# Altium schematic sheet 16-DDR4 ECC AND TERMINATIONS.SchDoc
size 513 x 386 mm
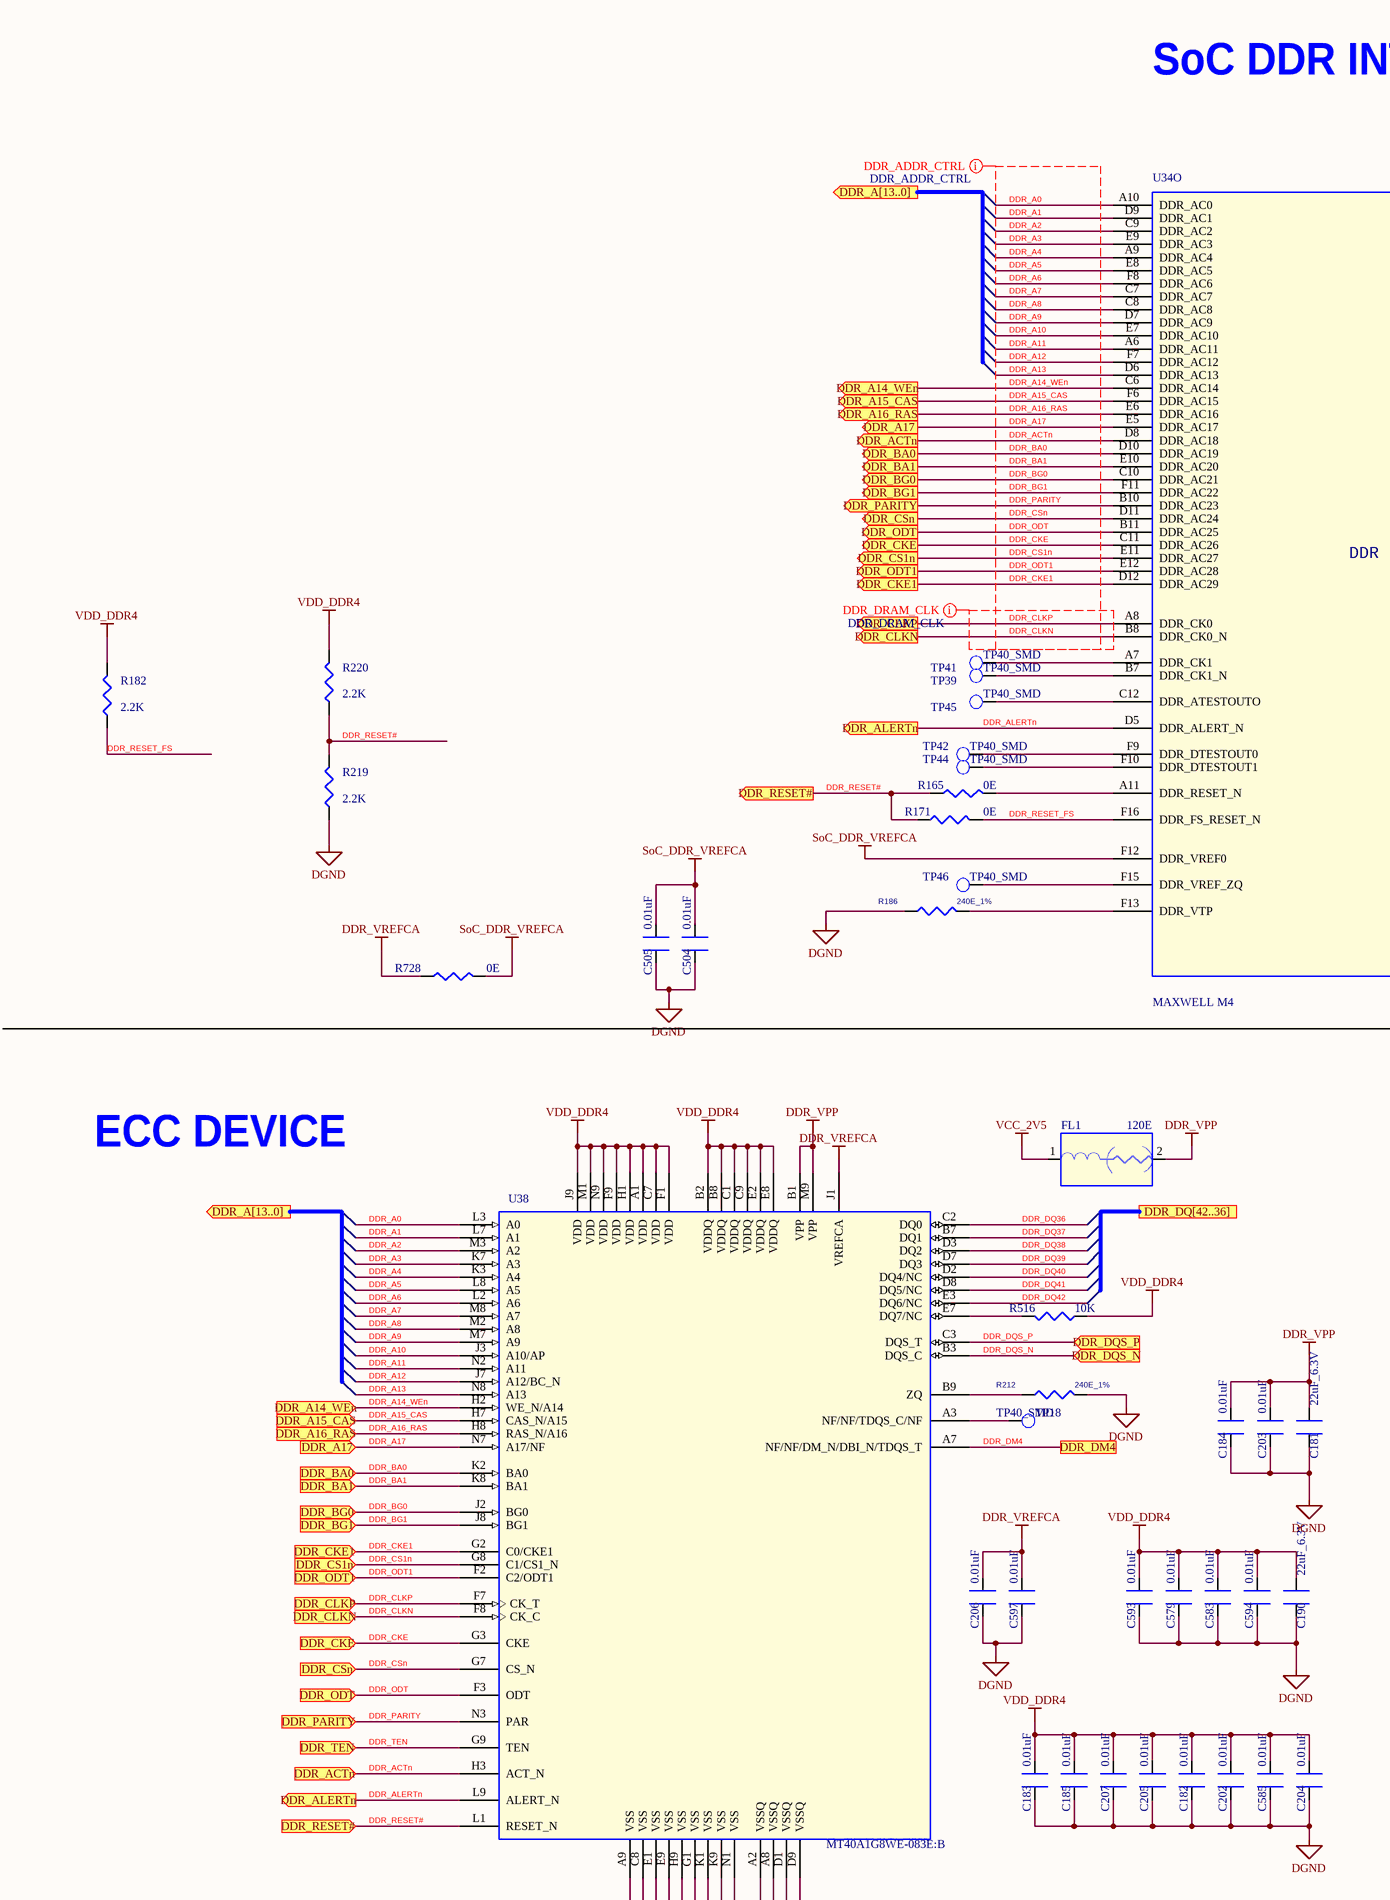
[diagram p0: 16-DDR4 ECC AND TERMINATIONS.SchDoc, top left]
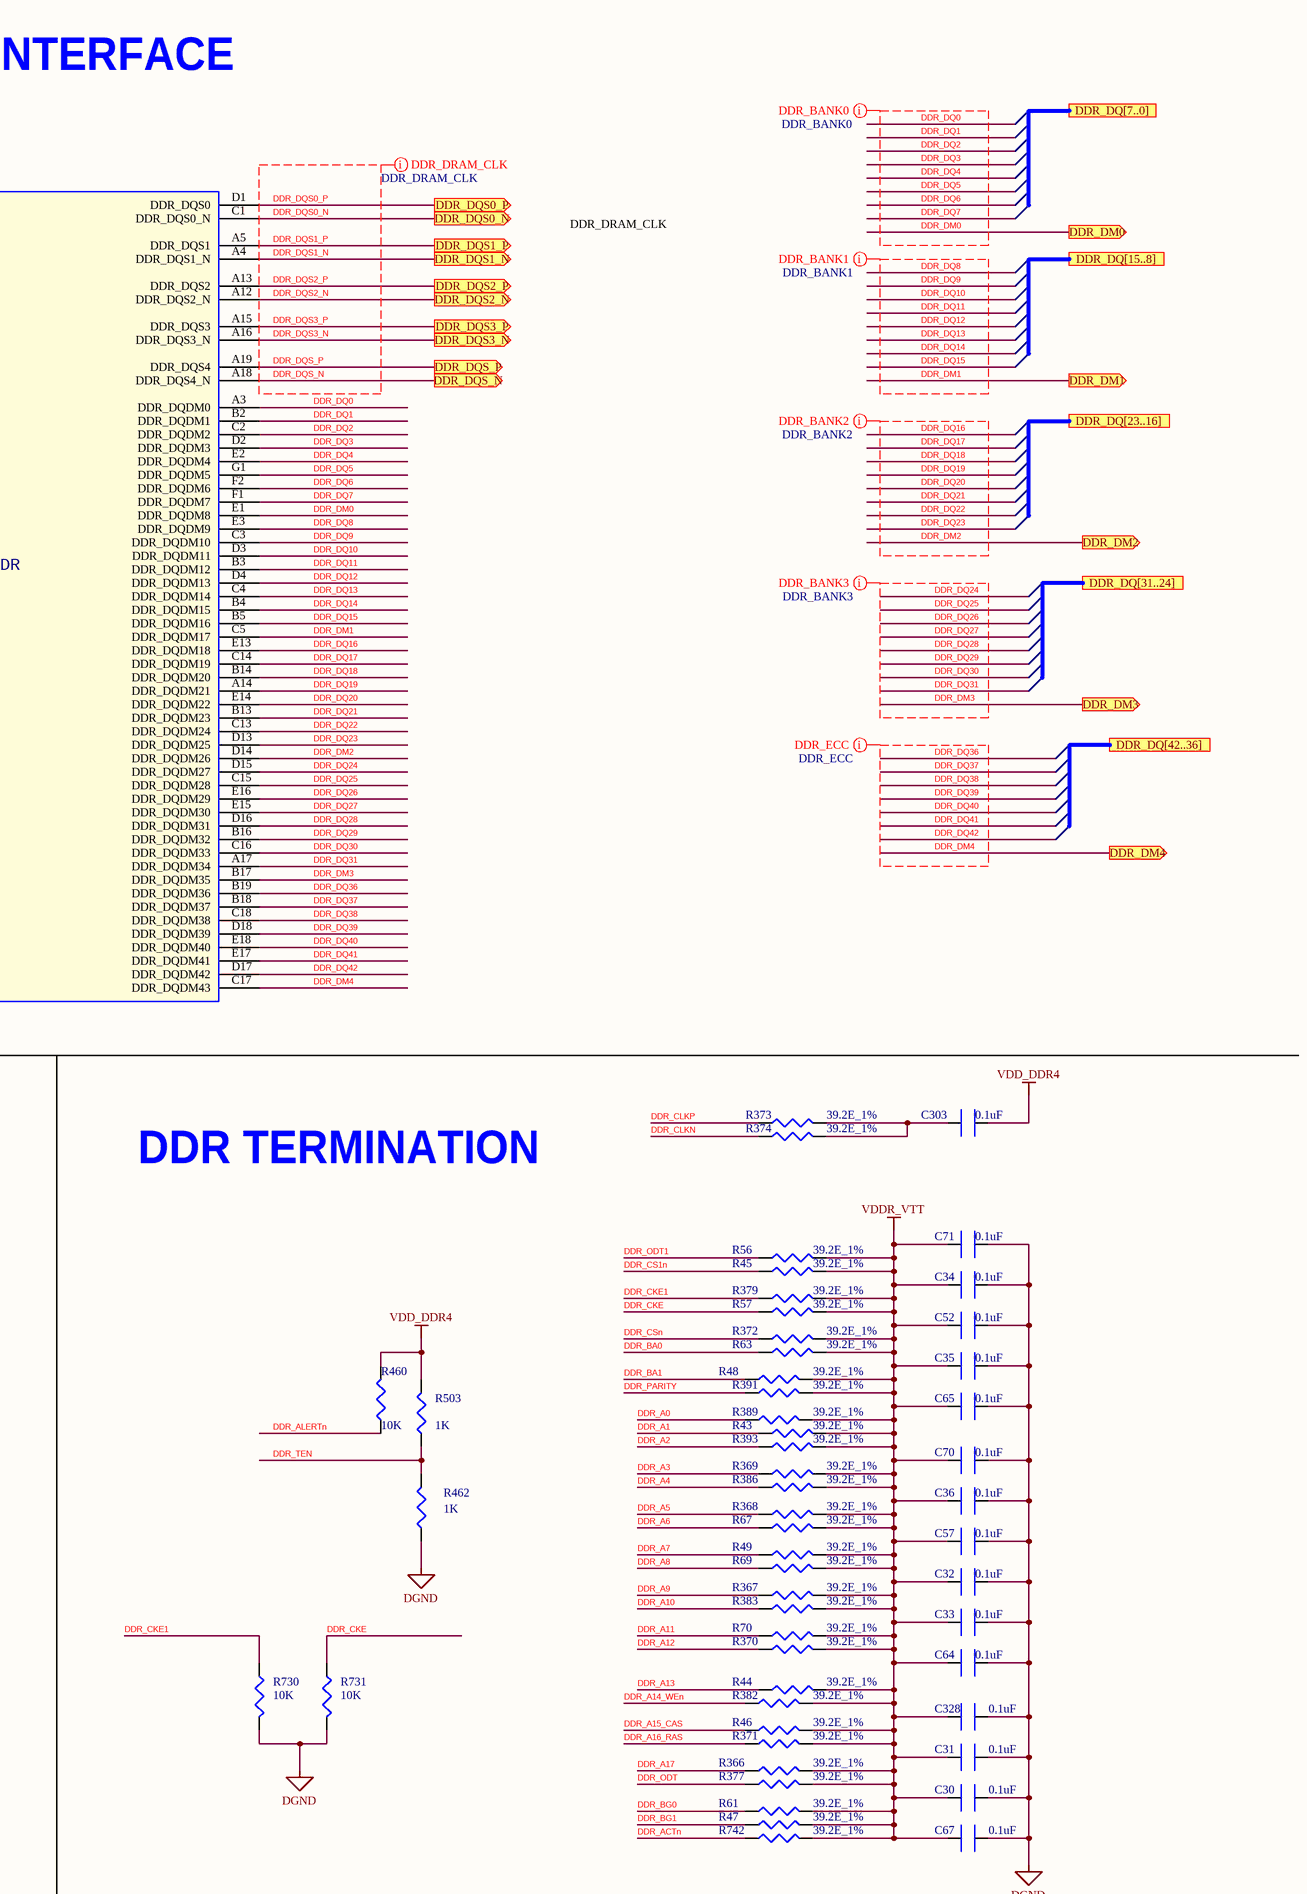
[diagram p1: 16-DDR4 ECC AND TERMINATIONS.SchDoc, top right]
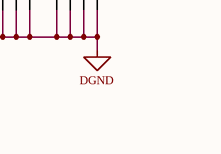
[diagram p2: 16-DDR4 ECC AND TERMINATIONS.SchDoc, bottom left]
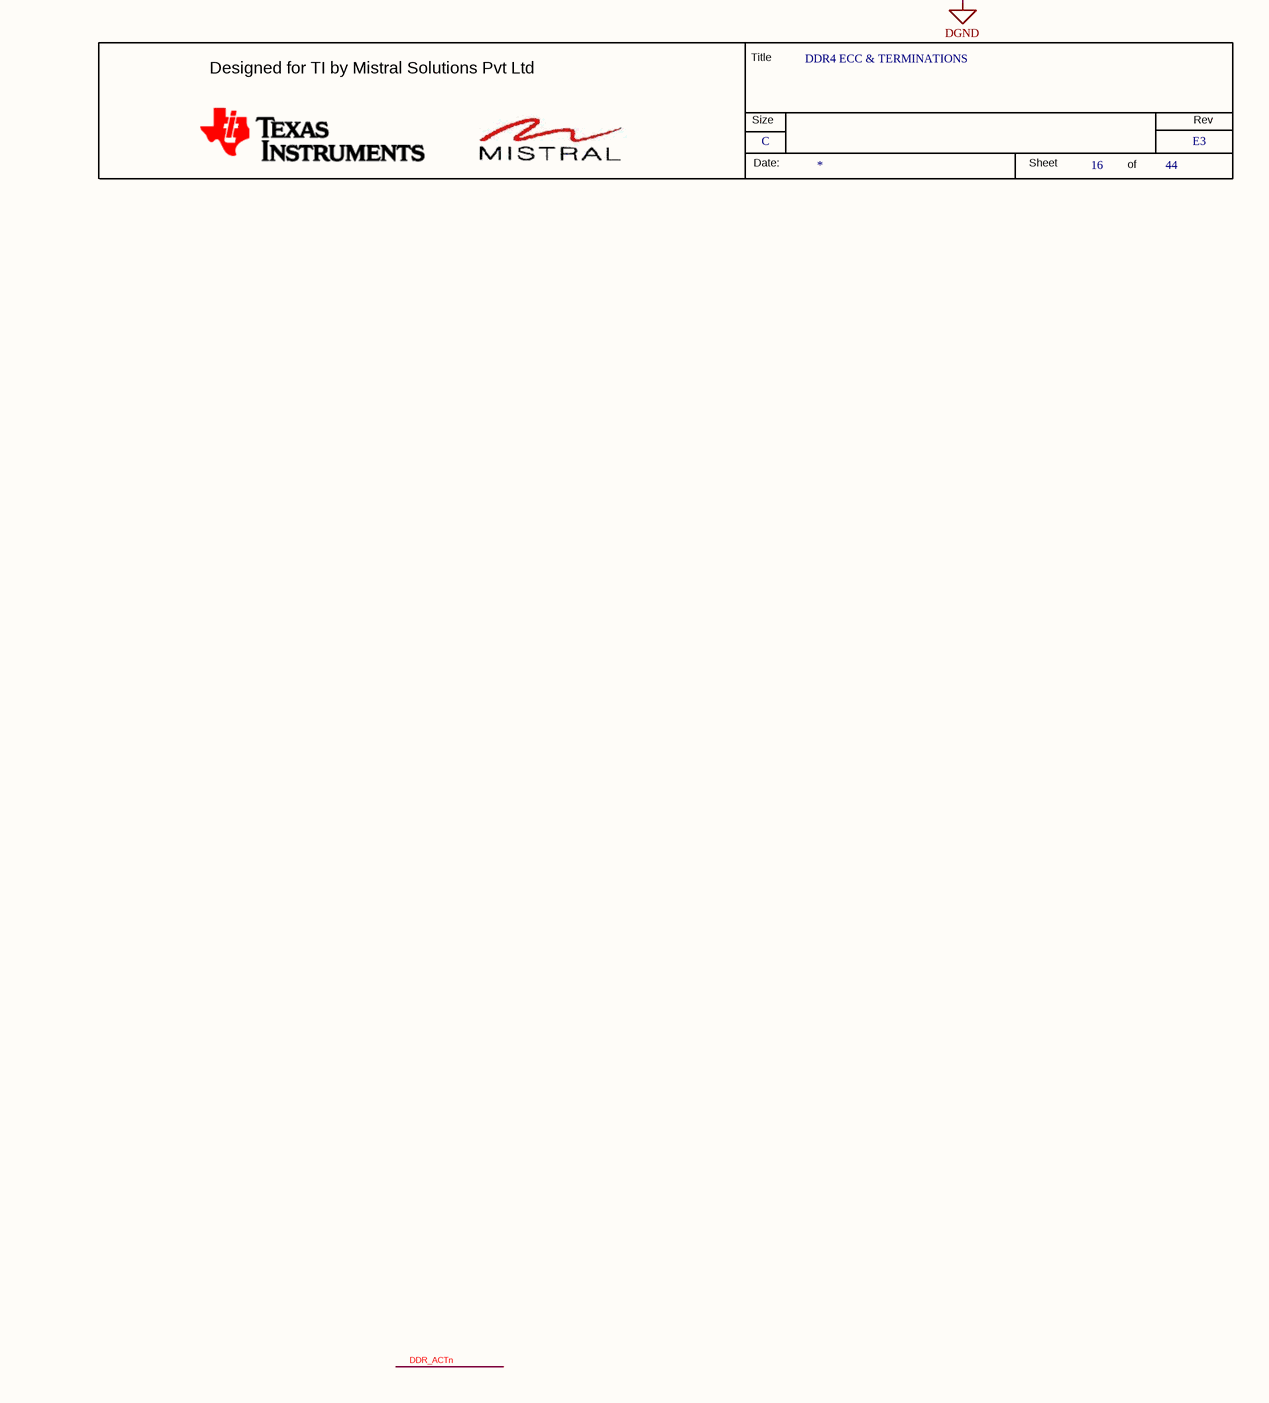
[diagram p3: 16-DDR4 ECC AND TERMINATIONS.SchDoc, bottom right]

## Parts
*  RevCode: E3  Title: DDR4 ECC & TERMINATIONS  Page Size: C  Page Number: 16  Page Count: 44  (hidden comment: MISTRAL_TITLEBLK_CSIZE)  (graphical)
C30  0.1uF  [CAP0201_0-5]
C31  0.1uF  [CAP0201_0-5]
C32  0.1uF  [CAP0201_0-5]
C33  0.1uF  [CAP0201_0-5]
C34  0.1uF  [CAP0201_0-5]
C35  0.1uF  [CAP0201_0-5]
C36  0.1uF  [CAP0201_0-5]
C52  0.1uF  [CAP0201_0-5]
C57  0.1uF  [CAP0201_0-5]
C64  0.1uF  [CAP0201_0-5]
C65  0.1uF  [CAP0201_0-5]
C67  0.1uF  [CAP0201_0-5]
C70  0.1uF  [CAP0201_0-5]
C71  0.1uF  [CAP0201_0-5]
C181  22uF_6.3V  [CAP0603]
C182  0.01uF  [CAP0201_0-5]
C183  0.01uF  [CAP0201_0-5]
C184  0.01uF  [CAP0201_0-5]
C185  0.01uF  [CAP0201_0-5]
C190  22uF_6.3V  [CAP0603]
C202  0.01uF  [CAP0201_0-5]
C203  0.01uF  [CAP0201_0-5]
C204  0.01uF  [CAP0201_0-5]
C205  0.01uF  [CAP0201_0-5]
C206  0.01uF  [CAP0201_0-5]
C207  0.01uF  [CAP0201_0-5]
C303  0.1uF  [CAP0201_0-5]
C328  0.1uF  [CAP0201_0-5]
C504  0.01uF  [CAP0201_0-5]
C505  0.01uF  [CAP0201_0-5]
C579  0.01uF  [CAP0201_0-5]
C583  0.01uF  [CAP0201_0-5]
C585  0.01uF  [CAP0201_0-5]
C593  0.01uF  [CAP0201_0-5]
C594  0.01uF  [CAP0201_0-5]
C597  0.01uF  [CAP0201_0-5]
FL1  120E  [EMIFIL_BLM15A_0402_0-6]
R43  39.2E_1%  [RES0402]
R44  39.2E_1%  [RES0402]
R45  39.2E_1%  [RES0402]
R46  39.2E_1%  [RES0402]
R47  39.2E_1%  [RES0402]
R48  39.2E_1%  [RES0402]
R49  39.2E_1%  [RES0402]
R56  39.2E_1%  [RES0402]
R57  39.2E_1%  [RES0402]
R61  39.2E_1%  [RES0402]
R63  39.2E_1%  [RES0402]
R67  39.2E_1%  [RES0402]
R69  39.2E_1%  [RES0402]
R70  39.2E_1%  [RES0402]
R165  0E  [RES0402_0-5]
R171  0E  [RES0402_0-5]
R182  2.2K  [RES0402_0-5]
R186  240E_1%  [RES0402]
R212  240E_1%  [RES0402]
R219  2.2K  [RES0402_0-5]
R220  2.2K  [RES0402_0-5]
R366  39.2E_1%  [RES0402]
R367  39.2E_1%  [RES0402]
R368  39.2E_1%  [RES0402]
R369  39.2E_1%  [RES0402]
R370  39.2E_1%  [RES0402]
R371  39.2E_1%  [RES0402]
R372  39.2E_1%  [RES0402]
R373  39.2E_1%  [RES0402]
R374  39.2E_1%  [RES0402]
R377  39.2E_1%  [RES0402]
R379  39.2E_1%  [RES0402]
R382  39.2E_1%  [RES0402]
R383  39.2E_1%  [RES0402]
R386  39.2E_1%  [RES0402]
R389  39.2E_1%  [RES0402]
R391  39.2E_1%  [RES0402]
R393  39.2E_1%  [RES0402]
R460  10K  [RES0402_0-5]
R462  1K  [RES0201]
R503  1K  [RES0201]
R516  10K  [RES0402_0-5]
R728  0E  [RES0402_0-5]
R730  10K  [RES0402_0-5]
R731  10K  [RES0402_0-5]
R742  39.2E_1%  [RES0402]
TP18  TP40_SMD  [TP40_SMD]
TP39  TP40_SMD  [TP40_SMD]
TP41  TP40_SMD  [TP40_SMD]
TP42  TP40_SMD  [TP40_SMD]
TP44  TP40_SMD  [TP40_SMD]
TP45  TP40_SMD  [TP40_SMD]
TP46  TP40_SMD  [TP40_SMD]
U34  MAXWELL M4  [BGA784_31-49_910X910_1-7]  (part O of 19)
U38  MT40A1G8WE-083E:B  [FBGA78_31-49_320X480_1-2]

## Ports
DDR_A14_WEn (in), DDR_A14_WEn (out), DDR_A15_CAS (in), DDR_A15_CAS (out), DDR_A16_RAS (in), DDR_A16_RAS (out), DDR_A17 (in), DDR_A17 (out), DDR_A[13..0] (out), DDR_ACTn (in), DDR_ACTn (out), DDR_ALERTn (out), DDR_BA0 (in), DDR_BA0 (out), DDR_BA1 (in), DDR_BA1 (out), DDR_BG0 (in), DDR_BG0 (out), DDR_BG1 (in), DDR_BG1 (out), DDR_CKE1 (in), DDR_CKE1 (out), DDR_CKE (in), DDR_CKE (out), DDR_CLKN (in), DDR_CLKN (out), DDR_CLKP (in), DDR_CLKP (out), DDR_CS1n (in), DDR_CS1n (out), DDR_CSn (in), DDR_CSn (out), DDR_DM0 (out), DDR_DM1 (out), DDR_DM2 (out), DDR_DM3 (out), DDR_DM4, DDR_DM4 (out), DDR_DQ[7..0], DDR_DQ[15..8], DDR_DQ[23..16], DDR_DQ[31..24], DDR_DQ[42..36], DDR_DQS0_N (out), DDR_DQS0_P (out), DDR_DQS1_N (out), DDR_DQS1_P (out), DDR_DQS2_N (out), DDR_DQS2_P (out), DDR_DQS3_N (out), DDR_DQS3_P (out), DDR_DQS_N (in), DDR_DQS_N (out), DDR_DQS_P (in), DDR_DQS_P (out), DDR_ODT1 (in), DDR_ODT1 (out), DDR_ODT (in), DDR_ODT (out), DDR_PARITY (in), DDR_PARITY (out), DDR_RESET# (in), DDR_RESET# (out), DDR_TEN (in)

## Nets
DDR_VPP: C181.1 C184.1 C203.1 FL1.2 U38.B1(VPP) U38.M9(VPP)
DDR_VREFCA: C206.1 C597.1 R728.1 U38.J1(VREFCA)
DGND: C30.2 C31.2 C32.2 C33.2 C34.2 C35.2 C36.2 C52.2 C57.2 C64.2 C65.2 C67.2 C70.2 C71.2 C181.2 C182.2 C183.2 C184.2 C185.2 C190.2 C202.2 C203.2 C204.2 C205.2 C206.2 C207.2 C328.2 C504.2 C505.2 C579.2 C583.2 C585.2 C593.2 C594.2 C597.2 R186.2 R212.2 R219.1 R462.1 R730.2 R731.2 U38.A2(VSSQ) U38.A8(VSSQ) U38.A9(VSS) U38.C8(VSS) U38.D1(VSSQ) U38.D9(VSSQ) U38.E1(VSS) U38.E9(VSS) U38.G1(VSS) U38.H9(VSS) U38.K1(VSS) U38.K9(VSS) U38.N1(VSS)
SoC_DDR_VREFCA: C504.1 C505.1 R728.2 U34.F12(DDR_VREF0)
VCC_2V5: FL1.1
VDD_DDR4: C182.1 C183.1 C185.1 C190.1 C202.1 C204.1 C205.1 C207.1 C303.1 C579.1 C583.1 C585.1 C593.1 C594.1 R182.2 R220.2 R460.2 R503.2 R516.1 U38.A1(VDD) U38.B2(VDDQ) U38.B8(VDDQ) U38.C1(VDDQ) U38.C7(VDD) U38.C9(VDDQ) U38.E2(VDDQ) U38.E8(VDDQ) U38.F1(VDD) U38.F9(VDD) U38.H1(VDD) U38.J9(VDD) U38.M1(VDD) U38.N9(VDD)
VDDR_VTT: C30.1 C31.1 C32.1 C33.1 C34.1 C35.1 C36.1 C52.1 C57.1 C64.1 C65.1 C67.1 C70.1 C71.1 C328.1 R43.2 R44.2 R45.2 R46.2 R47.2 R48.2 R49.2 R56.2 R57.2 R61.2 R63.2 R67.2 R69.2 R70.2 R366.2 R367.2 R368.2 R369.2 R370.2 R371.2 R372.2 R377.2 R379.2 R382.2 R383.2 R386.2 R389.2 R391.2 R393.2 R742.2
DDR_A0: R389.1 U34.A10(DDR_AC0) U38.L3(A0)
DDR_A1: R43.1 U34.D9(DDR_AC1) U38.L7(A1)
DDR_A2: R393.1 U34.C9(DDR_AC2) U38.M3(A2)
DDR_A3: R369.1 U34.E9(DDR_AC3) U38.K7(A3)
DDR_A4: R386.1 U34.A9(DDR_AC4) U38.K3(A4)
DDR_A5: R368.1 U34.E8(DDR_AC5) U38.L8(A5)
DDR_A6: R67.1 U34.F8(DDR_AC6) U38.L2(A6)
DDR_A7: R49.1 U34.C7(DDR_AC7) U38.M8(A7)
DDR_A8: R69.1 U34.C8(DDR_AC8) U38.M2(A8)
DDR_A9: R367.1 U34.D7(DDR_AC9) U38.M7(A9)
DDR_A10: R383.1 U34.E7(DDR_AC10) U38.J3(A10/AP)
DDR_A11: R70.1 U34.A6(DDR_AC11) U38.N2(A11)
DDR_A12: R370.1 U34.F7(DDR_AC12) U38.J7(A12/BC_N)
DDR_A13: R44.1 U34.D6(DDR_AC13) U38.N8(A13)
DDR_A14_WEn: R382.1 U34.C6(DDR_AC14) U38.H2(WE_N/A14) ; port DDR_A14_WEn
DDR_A15_CAS: R46.1 U34.F6(DDR_AC15) U38.H7(CAS_N/A15) ; port DDR_A15_CAS
DDR_A16_RAS: R371.1 U34.E6(DDR_AC16) U38.H8(RAS_N/A16) ; port DDR_A16_RAS
DDR_A17: R366.1 U34.E5(DDR_AC17) U38.N7(A17/NF) ; port DDR_A17
DDR_ACTn: R742.1 U34.D8(DDR_AC18) U38.H3(ACT_N) ; port DDR_ACTn
DDR_ALERTn: R460.1 U34.D5(DDR_ALERT_N) U38.L9(ALERT_N) ; port DDR_ALERTn
DDR_BA0: R63.1 U34.D10(DDR_AC19) U38.K2(BA0) ; port DDR_BA0
DDR_BA1: R48.1 U34.E10(DDR_AC20) U38.K8(BA1) ; port DDR_BA1
DDR_BG0: R61.1 U34.C10(DDR_AC21) U38.J2(BG0) ; port DDR_BG0
DDR_BG1: R47.1 U34.F11(DDR_AC22) U38.J8(BG1) ; port DDR_BG1
DDR_CKE: R57.1 R731.1 U34.C11(DDR_AC26) U38.G3(CKE) ; port DDR_CKE
DDR_CKE1: R379.1 R730.1 U34.D12(DDR_AC29) U38.G2(C0/CKE1) ; port DDR_CKE1
DDR_CLKN: R374.1 U34.B8(DDR_CK0_N) U38.F8(CK_C) ; port DDR_CLKN
DDR_CLKP: R373.1 U34.A8(DDR_CK0) U38.F7(CK_T) ; port DDR_CLKP
DDR_CS1n: R45.1 U34.E11(DDR_AC27) U38.G8(C1/CS1_N) ; port DDR_CS1n
DDR_CSn: R372.1 U34.D11(DDR_AC24) U38.G7(CS_N) ; port DDR_CSn
DDR_DM0: U34.E1(DDR_DQDM8) ; port DDR_DM0
DDR_DM1: U34.C5(DDR_DQDM17) ; port DDR_DM1
DDR_DM2: U34.D14(DDR_DQDM26) ; port DDR_DM2
DDR_DM3: U34.B17(DDR_DQDM35) ; port DDR_DM3
DDR_DM4: U34.C17(DDR_DQDM43) U38.A7(NF/NF/DM_N/DBI_N/TDQS_T) ; port DDR_DM4
DDR_DQ0: U34.A3(DDR_DQDM0)
DDR_DQ1: U34.B2(DDR_DQDM1)
DDR_DQ2: U34.C2(DDR_DQDM2)
DDR_DQ3: U34.D2(DDR_DQDM3)
DDR_DQ4: U34.E2(DDR_DQDM4)
DDR_DQ5: U34.G1(DDR_DQDM5)
DDR_DQ6: U34.F2(DDR_DQDM6)
DDR_DQ7: U34.F1(DDR_DQDM7)
DDR_DQ8: U34.E3(DDR_DQDM9)
DDR_DQ9: U34.C3(DDR_DQDM10)
DDR_DQ10: U34.D3(DDR_DQDM11)
DDR_DQ11: U34.B3(DDR_DQDM12)
DDR_DQ12: U34.D4(DDR_DQDM13)
DDR_DQ13: U34.C4(DDR_DQDM14)
DDR_DQ14: U34.B4(DDR_DQDM15)
DDR_DQ15: U34.B5(DDR_DQDM16)
DDR_DQ16: U34.E13(DDR_DQDM18)
DDR_DQ17: U34.C14(DDR_DQDM19)
DDR_DQ18: U34.B14(DDR_DQDM20)
DDR_DQ19: U34.A14(DDR_DQDM21)
DDR_DQ20: U34.E14(DDR_DQDM22)
DDR_DQ21: U34.B13(DDR_DQDM23)
DDR_DQ22: U34.C13(DDR_DQDM24)
DDR_DQ23: U34.D13(DDR_DQDM25)
DDR_DQ24: U34.D15(DDR_DQDM27)
DDR_DQ25: U34.C15(DDR_DQDM28)
DDR_DQ26: U34.E16(DDR_DQDM29)
DDR_DQ27: U34.E15(DDR_DQDM30)
DDR_DQ28: U34.D16(DDR_DQDM31)
DDR_DQ29: U34.B16(DDR_DQDM32)
DDR_DQ30: U34.C16(DDR_DQDM33)
DDR_DQ31: U34.A17(DDR_DQDM34)
DDR_DQ36: U34.B19(DDR_DQDM36) U38.C2(DQ0)
DDR_DQ37: U34.B18(DDR_DQDM37) U38.B7(DQ1)
DDR_DQ38: U34.C18(DDR_DQDM38) U38.D3(DQ2)
DDR_DQ39: U34.D18(DDR_DQDM39) U38.D7(DQ3)
DDR_DQ40: U34.E18(DDR_DQDM40) U38.D2(DQ4/NC)
DDR_DQ41: U34.E17(DDR_DQDM41) U38.D8(DQ5/NC)
DDR_DQ42: U34.D17(DDR_DQDM42) U38.E3(DQ6/NC)
DDR_DQS0_N: U34.C1(DDR_DQS0_N) ; port DDR_DQS0_N
DDR_DQS0_P: U34.D1(DDR_DQS0) ; port DDR_DQS0_P
DDR_DQS1_N: U34.A4(DDR_DQS1_N) ; port DDR_DQS1_N
DDR_DQS1_P: U34.A5(DDR_DQS1) ; port DDR_DQS1_P
DDR_DQS2_N: U34.A12(DDR_DQS2_N) ; port DDR_DQS2_N
DDR_DQS2_P: U34.A13(DDR_DQS2) ; port DDR_DQS2_P
DDR_DQS3_N: U34.A16(DDR_DQS3_N) ; port DDR_DQS3_N
DDR_DQS3_P: U34.A15(DDR_DQS3) ; port DDR_DQS3_P
DDR_DQS_N: U34.A18(DDR_DQS4_N) U38.B3(DQS_C) ; port DDR_DQS_N
DDR_DQS_P: U34.A19(DDR_DQS4) U38.C3(DQS_T) ; port DDR_DQS_P
DDR_ODT: R377.1 U34.B11(DDR_AC25) U38.F3(ODT) ; port DDR_ODT
DDR_ODT1: R56.1 U34.E12(DDR_AC28) U38.F2(C2/ODT1) ; port DDR_ODT1
DDR_PARITY: R391.1 U34.B10(DDR_AC23) U38.N3(PAR) ; port DDR_PARITY
DDR_RESET#: R165.1 R171.1 R219.2 R220.1 U38.L1(RESET_N) ; port DDR_RESET#
DDR_RESET_FS: R171.2 R182.1 U34.F16(DDR_FS_RESET_N)
DDR_TEN: R462.2 R503.1 U38.G9(TEN) ; port DDR_TEN
NetC303_2: C303.2 R373.2 R374.2
NetR165_2: R165.2 U34.A11(DDR_RESET_N)
NetR186_1: R186.1 U34.F13(DDR_VTP)
NetR212_1: R212.1 U38.B9(ZQ)
NetR516_2: R516.2 U38.E7(DQ7/NC)
NetTP18_1: TP18.1(TP) U38.A3(NF/NF/TDQS_C/NF)
NetTP39_1: TP39.1(TP) U34.B7(DDR_CK1_N)
NetTP41_1: TP41.1(TP) U34.A7(DDR_CK1)
NetTP42_1: TP42.1(TP) U34.F9(DDR_DTESTOUT0)
NetTP44_1: TP44.1(TP) U34.F10(DDR_DTESTOUT1)
NetTP45_1: TP45.1(TP) U34.C12(DDR_ATESTOUTO)
NetTP46_1: TP46.1(TP) U34.F15(DDR_VREF_ZQ)

## Layout directives
net class DDR_BANK0: DDR_DM0, DDR_DQ0, DDR_DQ1, DDR_DQ2, DDR_DQ3, DDR_DQ4, DDR_DQ5, DDR_DQ6, DDR_DQ7
net class DDR_BANK1: DDR_DM1, DDR_DQ8, DDR_DQ9, DDR_DQ10, DDR_DQ11, DDR_DQ12, DDR_DQ13, DDR_DQ14, DDR_DQ15
net class DDR_BANK2: DDR_DM2, DDR_DQ16, DDR_DQ17, DDR_DQ18, DDR_DQ19, DDR_DQ20, DDR_DQ21, DDR_DQ22, DDR_DQ23
net class DDR_BANK3: DDR_DM3, DDR_DQ24, DDR_DQ25, DDR_DQ26, DDR_DQ27, DDR_DQ28, DDR_DQ29, DDR_DQ30, DDR_DQ31
net class DDR_ECC: DDR_DM4, DDR_DQ36, DDR_DQ37, DDR_DQ38, DDR_DQ39, DDR_DQ40, DDR_DQ41, DDR_DQ42
net class DDR_ADDR_CTRL: DDR_A0, DDR_A1, DDR_A2, DDR_A3, DDR_A4, DDR_A5, DDR_A6, DDR_A7, DDR_A8, DDR_A9, DDR_A10, DDR_A11, DDR_A12, DDR_A13, DDR_A14_WEn, DDR_A15_CAS, DDR_A16_RAS, DDR_A17, DDR_ACTn, DDR_BA0, DDR_BA1, DDR_BG0, DDR_BG1, DDR_CKE, DDR_CKE1, DDR_CLKN, DDR_CLKP, DDR_CS1n, DDR_CSn, DDR_ODT, DDR_ODT1, DDR_PARITY
net class DDR_DRAM_CLK: DDR_CLKN, DDR_CLKP, DDR_DQS0_N, DDR_DQS0_P, DDR_DQS1_N, DDR_DQS1_P, DDR_DQS2_N, DDR_DQS2_P, DDR_DQS3_N, DDR_DQS3_P, DDR_DQS_N, DDR_DQS_P

## Notes on the sheet
- SoC DDR INTERFACE
- DDR_DRAM_CLK
- ECC DEVICE
- DDR TERMINATION
- (in symbol AM654X_BGA784, part O) DDR
- (in symbol MISTRAL_TITLEBLK_CSIZE) Title; Designed for TI by Mistral Solutions Pvt Ltd; Size; Rev; Date:; Sheet; of

## Library data of the parts
* = MISTRAL_TITLEBLK_CSIZE: Issue: 1.0; Page Create Date: March  8, 1995; Page Modify Date: *
C30 C32 C33 C36 C57 C64 C70 C71 C328 = CAP_Dup3: CAP CERAMIC 0.1uF 16V 10% X5R 0201; Mistral Part No: 120009030072-R; Mfr_name: MURATA; Mfr_part_number: GRM033R61C104KE84J; Part_type: CAPACITORS\CERAMIC; Project: TI_MAXIE_CPB; Customs_HS_Code: 85322990; Custom_Duty: 15%; Wattage: NA; Library Ref: CAP; Tolerance: 10%; Voltage: 16V; Package: 0201; Distributor_name: DIGIKEY; Distributor_part_number: 490-16742-1-ND; Height: 0.33MM; Datasheet: Y:\MIS_DATABASE\DATASHEETS\CAPACITORS\GRM033R61C104KE84.PDF; Crtd /date: MANIRAJA/120218; Chkd/date: MANIRAJA/120218; Weight: 0.33mg; Temperature: -55°C+85°C; MECHANICAL 3D STEP FILE: CAP0201_0-5; PCB Footprint: CAP0201_0-5
C31 C35 C303 = CAP_Dup3: CAP CERAMIC 0.1uF 16V 10% X5R 0201; Part_type: CAPACITORS\CERAMIC; Mfr_part_number: GRM033R61C104KE84J; Mfr_name: MURATA; Mistral Part No: 120009030072-R; Wattage: NA; Custom_Duty: 15%; Customs_HS_Code: 85322990; Project: TI_MAXIE_CPB; Library Ref: CAP; MECHANICAL 3D STEP FILE: CAP0201_0-5; Temperature: -55°C+85°C; Weight: 0.33mg; Chkd/date: MANIRAJA/120218; Crtd /date: MANIRAJA/120218; Datasheet: Y:\MIS_DATABASE\DATASHEETS\CAPACITORS\GRM033R61C104KE84.PDF; Height: 0.33MM; Distributor_part_number: 490-16742-1-ND; Distributor_name: DIGIKEY; Package: 0201; Voltage: 16V; Tolerance: 10%; PCB Footprint: CAP0201_0-5
C34 C52 C65 C67 = CAP_Dup3: CAP CERAMIC 0.1uF 16V 10% X5R 0201; Mistral Part No: 120009030072-R; Mfr_name: MURATA; Mfr_part_number: GRM033R61C104KE84J; Part_type: CAPACITORS\CERAMIC; Wattage: NA; Project: TI_MAXIE_CPB; Customs_HS_Code: 85322990; Custom_Duty: 15%; Library Ref: CAP; MECHANICAL 3D STEP FILE: CAP0201_0-5; Temperature: -55°C+85°C; Weight: 0.33mg; Tolerance: 10%; Voltage: 16V; Package: 0201; Distributor_name: DIGIKEY; Distributor_part_number: 490-16742-1-ND; Height: 0.33MM; Datasheet: Y:\MIS_DATABASE\DATASHEETS\CAPACITORS\GRM033R61C104KE84.PDF; Crtd /date: MANIRAJA/120218; Chkd/date: MANIRAJA/120218; PCB Footprint: CAP0201_0-5
C181 C190 = CAP_Dup3: CAP CERAMIC 22uF 6.3V 20% X5R 0603; Mistral Part No: 120015090007-R; Mfr_name: MURATA; Mfr_part_number: GRM188R60J226MEA0; Part_type: CAPACITORS\CERAMIC; Alternate_mfr_name_A: YAGEO AMERICA; Alternate_mfr_part_number_A: CC0603MRX5R5BB226; Project: OCTBTS_3000; Wattage: NA; Customs_HS_Code: 85322990; Custom_Duty: 15%; PCB Footprint: CAP0603; Library Ref: CAP; Tolerance: 20%; Voltage: 6.3V; Package: 0603; Distributor_name: DIGIKEY; Distributor_part_number: 490-7611-2-ND; Height: 1.00MM; Weight: NA; Temperature: -55°C+85°C; Datasheet: Y:\MIS_DATABASE\DATASHEETS\CAPACITORS\GRM188SERIES.PDF; Crtd /date: JEBRAN/090915; Chkd/date: JEBRAN/090915; Distributor_name_A: DIGIKEY; Distributor_part_number_A: 311-1815-1-ND
C182-C185 C202 C203 C205-C207 C504 C505 C579 C583 C585 C593 C594 C597 = CAP_Dup3: CAP CERAMIC 0.01uF 25V 10% X5R 0201; Part_type: CAPACITORS\CERAMIC; Mfr_part_number: GRM033R61E103KA12J; Mfr_name: MURATA; Mistral Part No: 120018010007-R; Wattage: NA; Custom_Duty: 15%; Customs_HS_Code: 85322990; Project: TI_MAXIE_CPB; Library Ref: CAP; MECHANICAL 3D STEP FILE: CAP0201_0-5; Temperature: -55°C+85°C; Weight: 0.33mg; PCB Footprint: CAP0201_0-5; Chkd/date: MANIRAJA/230118; Crtd /date: MANIRAJA/230118; Datasheet: Y:\MIS_DATABASE\DATASHEETS\CAPACITORS\GRM033R61E103KA12.PDF; Height: 0.33MM; Distributor_part_number: GRM033R61E103KA12J-ND; Distributor_name: DIGIKEY; Package: 0201; Voltage: 25V; Tolerance: 10%
C204 = CAP_Dup3: CAP CERAMIC 0.01uF 25V 10% X5R 0201; Mistral Part No: 120018010007-R; Mfr_name: MURATA; Mfr_part_number: GRM033R61E103KA12J; Part_type: CAPACITORS\CERAMIC; Wattage: NA; Project: TI_MAXIE_CPB; Customs_HS_Code: 85322990; Custom_Duty: 15%; Library Ref: CAP; MECHANICAL 3D STEP FILE: CAP0201_0-5; Temperature: -55°C+85°C; Weight: 0.33mg; PCB Footprint: CAP0201_0-5; Tolerance: 10%; Voltage: 25V; Package: 0201; Distributor_name: DIGIKEY; Distributor_part_number: GRM033R61E103KA12J-ND; Height: 0.33MM; Datasheet: Y:\MIS_DATABASE\DATASHEETS\CAPACITORS\GRM033R61E103KA12.PDF; Crtd /date: MANIRAJA/230118; Chkd/date: MANIRAJA/230118
FL1 = EMIFILTER_IND: FERRITE CHIP 120E 1.3A 0402; Mistral Part No: 130012030043-R; Mfr_name: MURATA; Mfr_part_number: BLM15PD121SN1; Part_type: MISC\FILTER; Project: GEN_3-8; Tolerance: 25%; Voltage: NA; Customs_HS_Code: 85437099; Custom_Duty: 24%; Footprint Path: Y:\MIS_DATABASE\Library\ALTIUM_TOOL\PCB_FOOTPRINTS\Altium_Footprint_Lib.PcbLib; Library Path: Y:\MIS_DATABASE\Library\ALTIUM_TOOL\SCHEMATICS_PARTS\MS_FILTER_Library.schlib; Footprint Ref: EMIFIL_BLM15A_0402_0-6; Library Ref: EMIFILTER_IND; Wattage: NA; Package: 0402; Distributor_name: DIGIKEY; Distributor_part_number: 490-5203-1-ND; Height: 0.55MM; Weight: 0.65mg; Temperature: -55°C+125°C; Datasheet: Y:\MIS_DATABASE\DATASHEETS\DISCRETES\INDUCTORS\BLM18K-SERIES.PDF; Crtd /date: CHAITHANYA/150312; Chkd/date: VASANTHA/010117; MECHANICAL 3D STEP FILE: EMIFIL_BLM15A_0402_0-6; PCB Footprint: EMIFIL_BLM15A_0402_0-6
R43 R44 R47 R49 R67 R69 R70 R366 R368-R371 R377 R382 R386 R391 R393 = RESISTOR_Dup5: RES 39.2E 1/16W 1% 0402; Mistral Part No: 110011040030-R; Mfr_name: STACKPOLE ELECTRONICS; Mfr_part_number: RMCF0402FT39R2; Part_type: RESISTORS\FIXED; Project: AOD_POD-BASECARD; Voltage: NA; Customs_HS_Code: 85332119; Custom_Duty: 15%; Library Ref: RESISTOR; Tolerance: 1%; Wattage: 1/16W; Package: 0402; Distributor_name: DIGIKEY; Distributor_part_number: RMCF0402FT39R2CT-ND; Height: 0.40MM; Weight: NA; Temperature: -55°C+155°C; Datasheet: Y:\MIS_DATABASE\DATASHEETS\RESISTORS\RMCF-SERIES.PDF; Crtd /date: MAZHAR/210411; Chkd/date: RAGESH/210411; PCB Footprint: RES0402
R45 R46 R48 R56 R57 R61 R63 R367 R372-R374 R379 R383 R389 R742 = RESISTOR_Dup5: RES 39.2E 1/16W 1% 0402; Part_type: RESISTORS\FIXED; Mfr_part_number: RMCF0402FT39R2; Mfr_name: STACKPOLE ELECTRONICS; Mistral Part No: 110011040030-R; Custom_Duty: 15%; Customs_HS_Code: 85332119; Voltage: NA; Project: AOD_POD-BASECARD; Library Ref: RESISTOR; Chkd/date: RAGESH/210411; Crtd /date: MAZHAR/210411; Datasheet: Y:\MIS_DATABASE\DATASHEETS\RESISTORS\RMCF-SERIES.PDF; Temperature: -55°C+155°C; Weight: NA; Height: 0.40MM; Distributor_part_number: RMCF0402FT39R2CT-ND; Distributor_name: DIGIKEY; Package: 0402; Wattage: 1/16W; Tolerance: 1%; PCB Footprint: RES0402
R165 = RESISTOR_Dup2: RES 0E 1/16W 0402; Mistral Part No: 110010080019-P; Mfr_name: VISHAY; Mfr_part_number: CRCW04020000Z0ED; Part_type: RESISTORS\FIXED; Voltage: NA; Project: PB_BUGBASE; Customs_HS_Code: 85332119; Custom_Duty: 15%; Footprint Path: Y:\MIS_DATABASE\Library\ALTIUM_TOOL\PCB_FOOTPRINTS\Altium_Footprint_Lib.PcbLib; Library Path: Y:\MIS_DATABASE\Library\ALTIUM_TOOL\SCHEMATICS_PARTS\MS_DISCRETE_Library.schlib; Footprint Ref: RES0402_0-5; Library Ref: RESISTOR; PCB Footprint: RES0402_0-5; MECHANICAL 3D STEP FILE: RES0402_0-5; Temperature: -55°C+155°C; Weight: 0.65g/1000pcs; Tolerance: NA; Wattage: 1/16W; Package: 0402; Distributor_name: DIGIKEY; Distributor_part_number: 541-0.0JCT-ND; Height: 0.40MM; Datasheet: Y:\MIS_DATABASE\DATASHEETS\RESISTORS\CRCW0603.PDF; Crtd /date: MUDDU/190810; Chkd/date: VASANTHA/201216; RoHS: Pb-Free
R171 = RESISTOR_Dup2: RES 0E 1/16W 0402; Part_type: RESISTORS\FIXED; Mfr_part_number: CRCW04020000Z0ED; Mfr_name: VISHAY; Mistral Part No: 110010080019-P; Custom_Duty: 15%; Customs_HS_Code: 85332119; Tolerance: NA; Project: PB_BUGBASE; NI_MARK: DNI; Footprint Path: Y:\MIS_DATABASE\Library\ALTIUM_TOOL\PCB_FOOTPRINTS\Altium_Footprint_Lib.PcbLib; Library Path: Y:\MIS_DATABASE\Library\ALTIUM_TOOL\SCHEMATICS_PARTS\MS_DISCRETE_Library.schlib; Footprint Ref: RES0402_0-5; Library Ref: RESISTOR; PCB Footprint: RES0402_0-5; RoHS: Pb-Free; Chkd/date: VASANTHA/201216; Crtd /date: MUDDU/190810; Datasheet: Y:\MIS_DATABASE\DATASHEETS\RESISTORS\CRCW0603.PDF; Height: 0.40MM; Distributor_part_number: 541-0.0JCT-ND; Distributor_name: DIGIKEY; Package: 0402; Wattage: 1/16W; Voltage: NA; Weight: 0.65g/1000pcs; Temperature: -55°C+155°C; MECHANICAL 3D STEP FILE: RES0402_0-5
R182 R220 = RESISTOR_Dup5: RES 2.2K 1/16W 5% 0402; Part_type: RESISTORS\FIXED; Mfr_part_number: RC0402JR-072K2L; Mfr_name: YAGEO AMERICA; Mistral Part No: 110010120018-R; Custom_Duty: 15%; Customs_HS_Code: 85332119; Voltage: NA; Project: TE4; Library Ref: RESISTOR; PCB Footprint: RES0402_0-5; MECHANICAL 3D STEP FILE: RES0402_0-5; Chkd/date: VASANTHA/061216; Crtd /date: BAVISH/021210; Datasheet: Y:\MIS_DATABASE\DATASHEETS\RESISTORS\YAGEO.PDF; Temperature: -55°C+155°C; Weight: 0.65mg; Height: 0.40MM; Distributor_part_number: 311-2.2KJRCT-ND; Distributor_name: DIGIKEY; Package: 0402; Wattage: 1/16W; Tolerance: 5%; Footprint Path: VALUE IS VAILABLE 3 TIMES
R186 = RESISTOR_Dup1: RES 240E 1/10W 1% 0402; Part_type: RESISTORS\FIXED; Mfr_part_number: ERJ-2RKF2400X; Mfr_name: PANASONIC-ECG; Mistral Part No: 110011060017-R; Custom_Duty: 15%; Customs_HS_Code: 85332119; Voltage: NA; Project: AM4515_EVM_LCD; Library Ref: RESISTOR; Chkd/date: MAZHAR/150611; Crtd /date: BAVISH/020611; Datasheet: Y:\MIS_DATABASE\DATASHEETS\RESISTORS\ERJ-2R.PDF; Temperature: -55°C+125°C; Weight: 0.8/1000g; Height: 0.40MM; Distributor_part_number: P240LCT-ND; Distributor_name: DIGIKEY; Package: 0402; Wattage: 1/10W; Tolerance: 1%; PCB Footprint: RES0402
R212 = RESISTOR_Dup1: RES 240E 1/10W 1% 0402; Mistral Part No: 110011060017-R; Mfr_name: PANASONIC-ECG; Mfr_part_number: ERJ-2RKF2400X; Part_type: RESISTORS\FIXED; Project: AM4515_EVM_LCD; Voltage: NA; Customs_HS_Code: 85332119; Custom_Duty: 15%; Library Ref: RESISTOR; PCB Footprint: RES0402; Tolerance: 1%; Wattage: 1/10W; Package: 0402; Distributor_name: DIGIKEY; Distributor_part_number: P240LCT-ND; Height: 0.40MM; Weight: 0.8/1000g; Temperature: -55°C+125°C; Datasheet: Y:\MIS_DATABASE\DATASHEETS\RESISTORS\ERJ-2R.PDF; Crtd /date: BAVISH/020611; Chkd/date: MAZHAR/150611
R219 = RESISTOR_Dup5: RES 2.2K 1/16W 5% 0402; Part_type: RESISTORS\FIXED; Mfr_part_number: RC0402JR-072K2L; Mfr_name: YAGEO AMERICA; Mistral Part No: 110010120018-R; Custom_Duty: 15%; Customs_HS_Code: 85332119; Voltage: NA; Project: TE4; NI_MARK: DNI; Library Ref: RESISTOR; PCB Footprint: RES0402_0-5; MECHANICAL 3D STEP FILE: RES0402_0-5; Chkd/date: VASANTHA/061216; Crtd /date: BAVISH/021210; Datasheet: Y:\MIS_DATABASE\DATASHEETS\RESISTORS\YAGEO.PDF; Temperature: -55°C+155°C; Weight: 0.65mg; Height: 0.40MM; Distributor_part_number: 311-2.2KJRCT-ND; Distributor_name: DIGIKEY; Package: 0402; Wattage: 1/16W; Tolerance: 5%; Footprint Path: VALUE IS VAILABLE 3 TIMES
R460 = RESISTOR_Dup5: RES 10K 1/16W 5% 0402; Mistral Part No: 110009030208-R; Mfr_name: YAGEO AMERICA; Mfr_part_number: RC0402JR-0710KL; Part_type: RESISTORS\FIXED; Project: HSE; Voltage: NA; Customs_HS_Code: 85332119; Custom_Duty: 15%; Footprint Path: Y:\MIS_DATABASE\Library\ALTIUM_TOOL\PCB_FOOTPRINTS\Altium_Footprint_Lib.PcbLib; Library Path: Y:\MIS_DATABASE\Library\ALTIUM_TOOL\SCHEMATICS_PARTS\MS_DISCRETE_Library.schlib; Footprint Ref: RES0402_0-5; Library Ref: RESISTOR; PCB Footprint: RES0402_0-5; Tolerance: 5%; Wattage: 1/16W; Package: 0402; Distributor_name: DIGIKEY; Distributor_part_number: 311-10KJRCT-ND; Height: 0.40MM; Weight: 0.65mg; Temperature: -55°C+155°C; Datasheet: Y:\MIS_DATABASE\DATASHEETS\RESISTORS\YAGEO-RC0402.PDF; Crtd /date: MAZHAR/230805; Chkd/date: VASANTHA/061216; RoHS: Pb-Free; MECHANICAL 3D STEP FILE: RES0402_0-5
R462 = RESISTOR_Dup4: RES 1K 1/20W 5% 0201; Mistral Part No: 110015080014-R; Mfr_name: VISHAY; Mfr_part_number: CRCW02011K00FKED; Part_type: RESISTORS\FIXED; Project: OCTASIC_3000; Voltage: NA; Customs_HS_Code: 85332119; Custom_Duty: 15%; Library Ref: RESISTOR; Tolerance: 5%; Wattage: 1/20W; Package: 0201; Distributor_name: DIGIKEY; Distributor_part_number: 541-1.00KAABCT-ND; Height: 0.28MM; Weight: NA; Temperature: -55°C+155°C; Datasheet: Y:\MIS_DATABASE\DATASHEETS\RESISTORS\CRCW0201.PDF; Crtd /date: JEBRAN/110815; Chkd/date: JEBRAN/110815; PCB Footprint: RES0201
R503 = RESISTOR_Dup4: RES 1K 1/20W 5% 0201; Mistral Part No: 110015080014-R; Mfr_name: VISHAY; Mfr_part_number: CRCW02011K00FKED; Part_type: RESISTORS\FIXED; Project: OCTASIC_3000; Voltage: NA; Customs_HS_Code: 85332119; Custom_Duty: 15%; NI_MARK: DNI; Library Ref: RESISTOR; Tolerance: 5%; Wattage: 1/20W; Package: 0201; Distributor_name: DIGIKEY; Distributor_part_number: 541-1.00KAABCT-ND; Height: 0.28MM; Weight: NA; Temperature: -55°C+155°C; Datasheet: Y:\MIS_DATABASE\DATASHEETS\RESISTORS\CRCW0201.PDF; Crtd /date: JEBRAN/110815; Chkd/date: JEBRAN/110815; PCB Footprint: RES0201
R516 = RESISTOR_Dup5: RES 10K 1/16W 5% 0402; Part_type: RESISTORS\FIXED; Mfr_part_number: RC0402JR-0710KL; Mfr_name: YAGEO AMERICA; Mistral Part No: 110009030208-R; Custom_Duty: 15%; Customs_HS_Code: 85332119; Voltage: NA; Project: HSE; Footprint Path: Y:\MIS_DATABASE\Library\ALTIUM_TOOL\PCB_FOOTPRINTS\Altium_Footprint_Lib.PcbLib; Library Path: Y:\MIS_DATABASE\Library\ALTIUM_TOOL\SCHEMATICS_PARTS\MS_DISCRETE_Library.schlib; Footprint Ref: RES0402_0-5; Library Ref: RESISTOR; PCB Footprint: RES0402_0-5; MECHANICAL 3D STEP FILE: RES0402_0-5; RoHS: Pb-Free; Chkd/date: VASANTHA/061216; Crtd /date: MAZHAR/230805; Datasheet: Y:\MIS_DATABASE\DATASHEETS\RESISTORS\YAGEO-RC0402.PDF; Temperature: -55°C+155°C; Weight: 0.65mg; Height: 0.40MM; Distributor_part_number: 311-10KJRCT-ND; Distributor_name: DIGIKEY; Package: 0402; Wattage: 1/16W; Tolerance: 5%
R728 = RESISTOR_Dup5: RES 0E 1/16W 0402; Mistral Part No: 110010080019-P; Mfr_name: VISHAY; Mfr_part_number: CRCW04020000Z0ED; Part_type: RESISTORS\FIXED; Project: PB_BUGBASE; Tolerance: NA; Customs_HS_Code: 85332119; Custom_Duty: 15%; NI_MARK: DNI; Footprint Path: Y:\MIS_DATABASE\Library\ALTIUM_TOOL\PCB_FOOTPRINTS\Altium_Footprint_Lib.PcbLib; Library Path: Y:\MIS_DATABASE\Library\ALTIUM_TOOL\SCHEMATICS_PARTS\MS_DISCRETE_Library.schlib; Footprint Ref: RES0402_0-5; Library Ref: RESISTOR; PCB Footprint: RES0402_0-5; Voltage: NA; Wattage: 1/16W; Package: 0402; Distributor_name: DIGIKEY; Distributor_part_number: 541-0.0JCT-ND; Height: 0.40MM; Weight: 0.65g/1000pcs; Temperature: -55°C+155°C; Datasheet: Y:\MIS_DATABASE\DATASHEETS\RESISTORS\CRCW0603.PDF; Crtd /date: MUDDU/190810; Chkd/date: VASANTHA/201216; RoHS: Pb-Free; MECHANICAL 3D STEP FILE: RES0402_0-5
R730 R731 = RESISTOR_Dup5: RES 10K 1/16W 5% 0402; Mistral Part No: 110009030208-R; Mfr_name: YAGEO AMERICA; Mfr_part_number: RC0402JR-0710KL; Part_type: RESISTORS\FIXED; Project: HSE; Voltage: NA; Customs_HS_Code: 85332119; Custom_Duty: 15%; NI_MARK: DNI; Footprint Path: Y:\MIS_DATABASE\Library\ALTIUM_TOOL\PCB_FOOTPRINTS\Altium_Footprint_Lib.PcbLib; Library Path: Y:\MIS_DATABASE\Library\ALTIUM_TOOL\SCHEMATICS_PARTS\MS_DISCRETE_Library.schlib; Footprint Ref: RES0402_0-5; Library Ref: RESISTOR; PCB Footprint: RES0402_0-5; Tolerance: 5%; Wattage: 1/16W; Package: 0402; Distributor_name: DIGIKEY; Distributor_part_number: 311-10KJRCT-ND; Height: 0.40MM; Weight: 0.65mg; Temperature: -55°C+155°C; Datasheet: Y:\MIS_DATABASE\DATASHEETS\RESISTORS\YAGEO-RC0402.PDF; Crtd /date: MAZHAR/230805; Chkd/date: VASANTHA/061216; RoHS: Pb-Free; MECHANICAL 3D STEP FILE: RES0402_0-5
TP18 TP39 TP45 = TESTPOINT: TESTPOINT CIR 40 SMD; Mfr_name: LOCAL; Mistral Part No: 130009030933; MECHANICAL 3D STEP FILE: NA; Project: RAINIER-3; NI_MARK: DNI; Footprint Ref: TP40_SMD; Library Ref: TESTPOINT; Footprint Path: Y:\MIS_DATABASE\Library\ALTIUM_TOOL\PCB_FOOTPRINTS\Altium_Footprint_Lib.PcbLib; Library Path: Y:\MIS_DATABASE\Library\ALTIUM_TOOL\SCHEMATICS_PARTS\MS_DISCRETE_Library.schlib; Datasheet: NA; Temperature: NA; Weight: NA; Wattage: NA; Voltage: NA; Tolerance: NA; PCB Footprint: TP40_SMD; Chkd/date: MAZHAR/190505; Crtd /date: MAZHAR/190505; Height: NA; Distributor_part_number: NA; Distributor_name: NA; Package: SMD; Part_type: TESTPOINT; Mfr_part_number: TP40_SMD; RoHS: NA
TP41 TP42 TP44 TP46 = TESTPOINT: TESTPOINT CIR 40 SMD; Mistral Part No: 130009030933; Mfr_name: LOCAL; MECHANICAL 3D STEP FILE: NA; Project: RAINIER-3; NI_MARK: DNI; Footprint Ref: TP40_SMD; Library Ref: TESTPOINT; Footprint Path: Y:\MIS_DATABASE\Library\ALTIUM_TOOL\PCB_FOOTPRINTS\Altium_Footprint_Lib.PcbLib; Library Path: Y:\MIS_DATABASE\Library\ALTIUM_TOOL\SCHEMATICS_PARTS\MS_DISCRETE_Library.schlib; Datasheet: NA; Temperature: NA; Weight: NA; Wattage: NA; Voltage: NA; Tolerance: NA; Mfr_part_number: TP40_SMD; Part_type: TESTPOINT; Package: SMD; Distributor_name: NA; Distributor_part_number: NA; Height: NA; Crtd /date: MAZHAR/190505; Chkd/date: MAZHAR/190505; PCB Footprint: TP40_SMD; RoHS: NA
U34 = AM654X_BGA784: IC MAXWELL MICRO CONTROLLER UNIT BGA784; Mistral Part No: 141217100003; Mfr_name: TEXAS INSTRUMENTS; Mfr_part_number: MAXWELL M4_EVM; Part_type: ICS\DIGITAL\MICROCONTROLLER; Project: TI_MAXIE_CPB; Tolerance: NA; Customs_HS_Code: 85423100; Custom_Duty: 15%; Library Ref: AM654X_BGA784; Voltage: NA; Wattage: NA; Package: BGA784; Distributor_name: NA; Distributor_part_number: NA; Height: 1.63MM; Weight: NA; Temperature: NA; Datasheet: Y:\MIS_DATABASE\DATASHEETS\ICS\DIGITAL\MICROCONTROLLER\MAXWELLM4.PDF; Crtd /date: MANIRAJA/130717; Chkd/date: MANIRAJA/130717; MECHANICAL 3D STEP FILE: BGA784_31-49_910X910_1-7; PCB Footprint: BGA784_31-49_910X910_1-7
U38 = MT40A1G8WE-083_FBGA78: IC 1G8 DDR4 SDRAM MEMORY FBGA78; Mistral Part No: 141117080006-R; Mfr_name: MICRON; Part_type: ICS\DIGITAL\MEMORY; Project: TI_MAXIE_CPB; Tolerance: NA; Customs_HS_Code: 85423100; Custom_Duty: 15%; Library Ref: MT40A1G8WE-083_FBGA78; PCB Footprint: FBGA78_31-49_320X480_1-2; Mfr_part_number: MT40A1G8WE-083E:B; Voltage: NA; Wattage: NA; Package: FBGA78; Distributor_name: DIGIKEY; Distributor_part_number: 557-1727-1-ND; Height: 1.20MM; Weight: NA; Temperature: 0°C+95°C; Datasheet: Y:\MIS_DATABASE\DATASHEETS\ICS\MEMORY\MT40AXX.PDF; Crtd /date: MANIRAJA/220817; Chkd/date: MANIRAJA/220817; MECHANICAL 3D STEP FILE: FBGA78_31-49_320X480_1-2